# EAGLE design OpenBook (EAGLE 9.7.0)
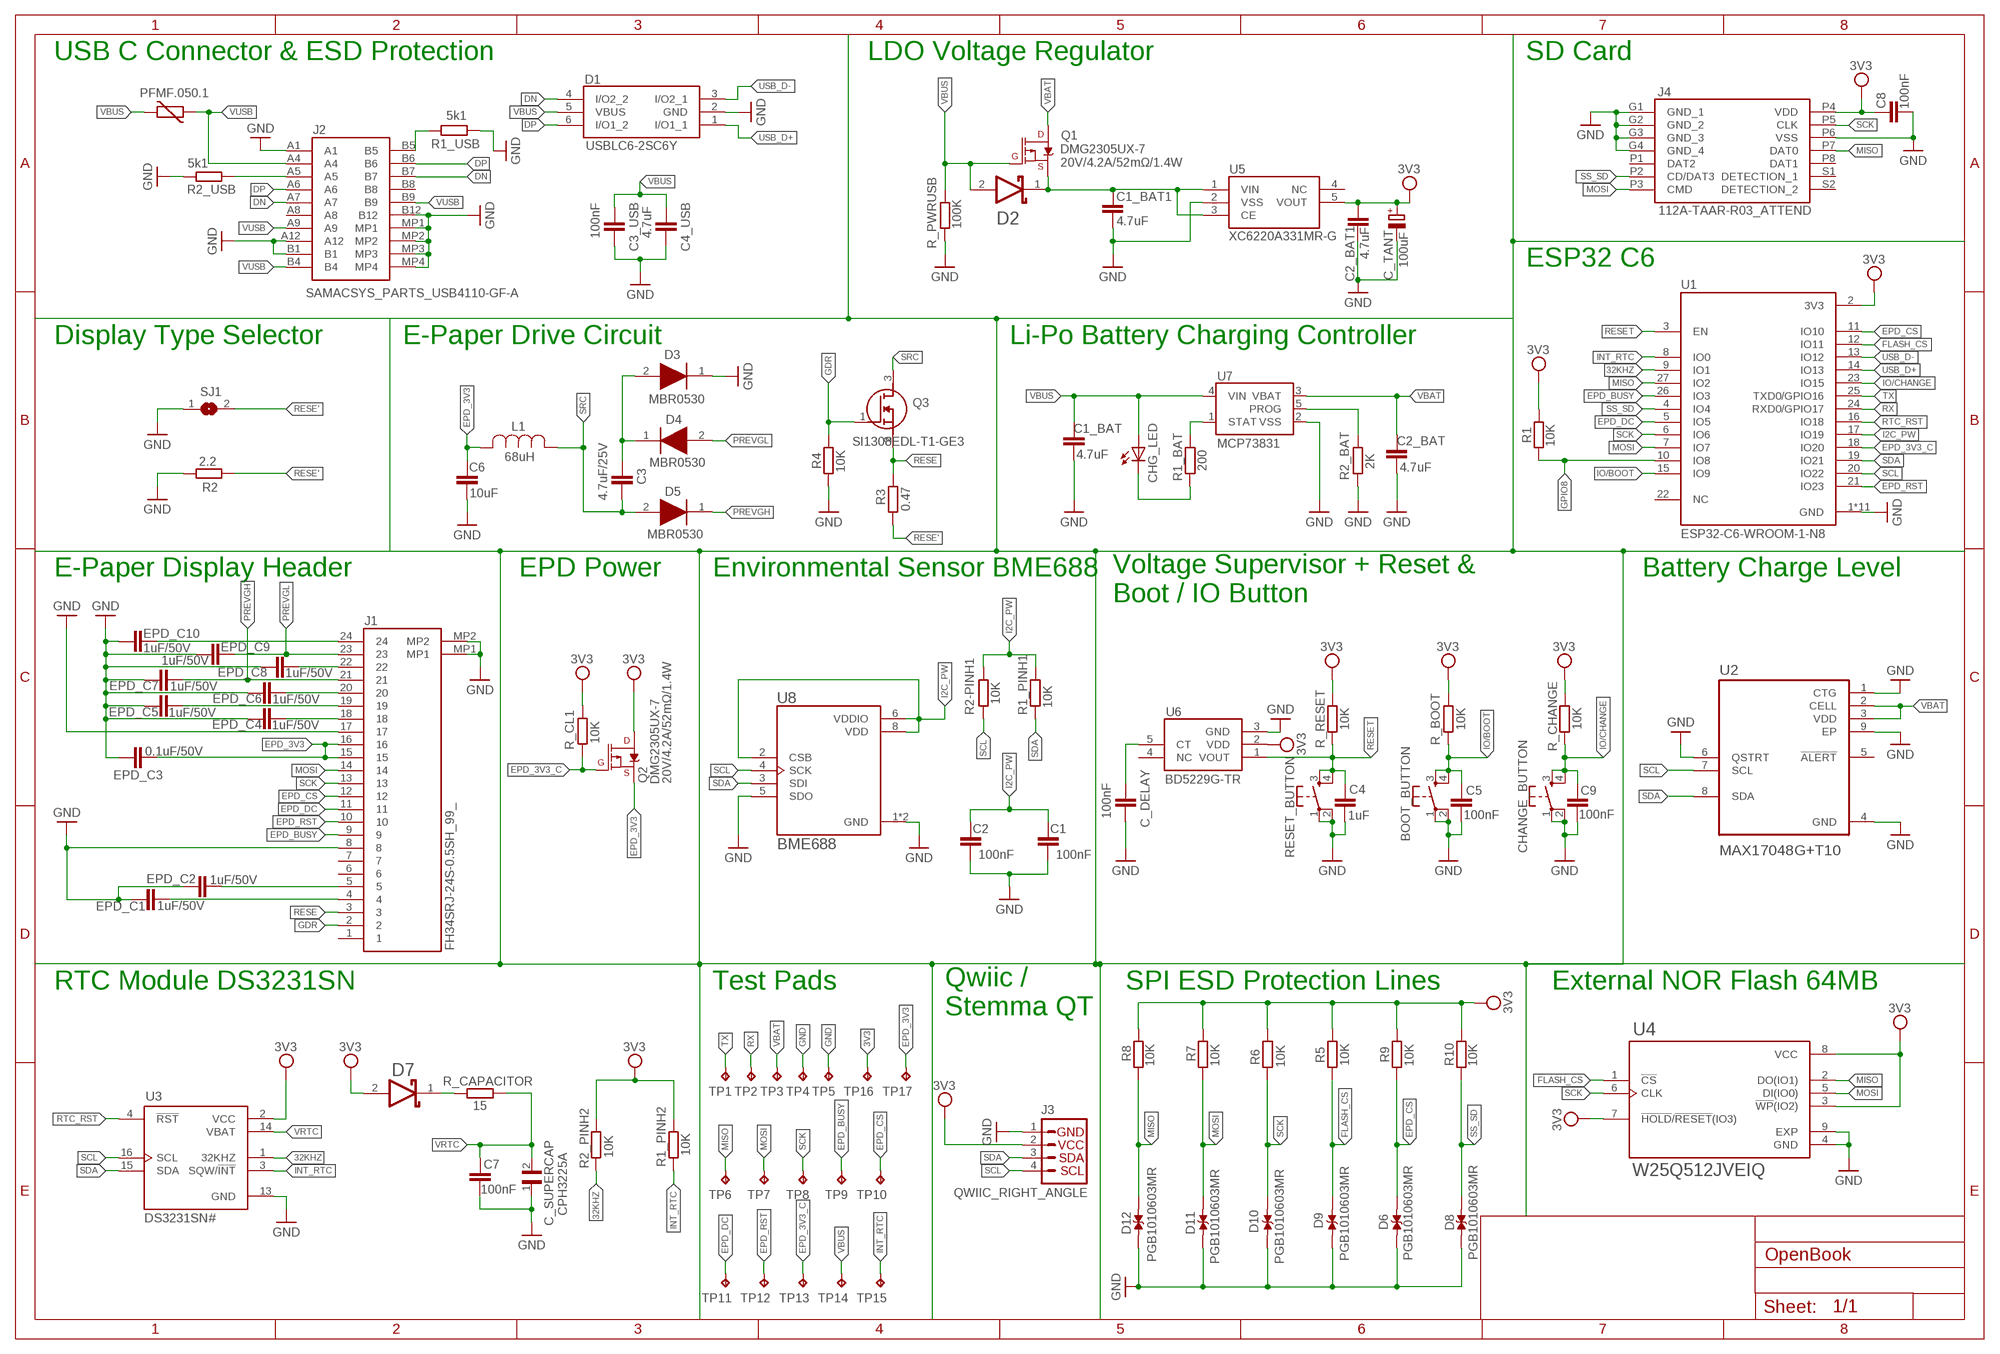
[diagram p0: schematic, sheet 1]

## Parts
BOOT_BUTTON  BUTTON_CUSYOMV1  [MYBUTTON]
C1  100nF  ESP32_WROVER_EAGLE-LTSPICE_C0402  [EAGLE-LTSPICE_C0402]
C1_BAT  4.7uF  ESP32_WROVER_EAGLE-LTSPICE_C0402  [EAGLE-LTSPICE_C0402]
C1_BAT1  4.7uF  ESP32_WROVER_EAGLE-LTSPICE_C0402  [EAGLE-LTSPICE_C0402]
C2  100nF  ESP32_WROVER_EAGLE-LTSPICE_C0402  [EAGLE-LTSPICE_C0402]
C2_BAT  4.7uF  ESP32_WROVER_EAGLE-LTSPICE_C0402  [EAGLE-LTSPICE_C0402]
C2_BAT1  4.7uF  ESP32_WROVER_EAGLE-LTSPICE_C0402  [EAGLE-LTSPICE_C0402]
C3  4.7uF/25V  ESP32_WROVER_EAGLE-LTSPICE_C0402  [EAGLE-LTSPICE_C0402]
C3_USB  100nF  ESP32_WROVER_EAGLE-LTSPICE_C0402  [EAGLE-LTSPICE_C0402]
C4  1uF  ESP32_WROVER_EAGLE-LTSPICE_C0402  [EAGLE-LTSPICE_C0402]
C4_USB  4.7uF  ESP32_WROVER_EAGLE-LTSPICE_C0402  [EAGLE-LTSPICE_C0402]
C5  100nF  ESP32_WROVER_EAGLE-LTSPICE_C0402  [EAGLE-LTSPICE_C0402]
C6  10uF  ESP32_WROVER_EAGLE-LTSPICE_C0402  [EAGLE-LTSPICE_C0402]
C7  100nF  ESP32_WROVER_EAGLE-LTSPICE_C0402  [EAGLE-LTSPICE_C0402]
C8  100nF  ESP32_WROVER_EAGLE-LTSPICE_C0402  [EAGLE-LTSPICE_C0402]
C9  100nF  ESP32_WROVER_EAGLE-LTSPICE_C0402  [EAGLE-LTSPICE_C0402]
C_DELAY  100nF  ESP32_WROVER_EAGLE-LTSPICE_C0402  [EAGLE-LTSPICE_C0402]
C_SUPERCAP  CPH3225A  [CAPCP3225X100N]
C_TANT  100uF  RCL_CPOL-EUCT3528  [RCL_CT3528]
CHANGE_BUTTON  BUTTON_CUSYOMV1  [MYBUTTON]
CHG_LED  ADAFRUIT_LEDCHIP-LED0603  [ADAFRUIT_CHIP-LED0603]
D1  USBLC6-2SC6Y  [SON50P200X200X80-9N]
D2  ESP32_WROVER_AVX---SD0805S020S1R0_AVX_SD0805S020S1R0_0_0AVX_SD0805S020S1R0_0_0  [ESP32_WROVER_AVX---SD0805S020S1R0_AVX_SD0805S020S1R0_0]
D3  MBR0530  [SOD3716X135N]
D4  MBR0530  [SOD3716X135N]
D5  MBR0530  [SOD3716X135N]
D6  PGB1010603MR  [DIOC1608X36N]
D7  ESP32_WROVER_AVX---SD0805S020S1R0_AVX_SD0805S020S1R0_0_0AVX_SD0805S020S1R0_0_0  [ESP32_WROVER_AVX---SD0805S020S1R0_AVX_SD0805S020S1R0_0]
D8  PGB1010603MR  [DIOC1608X36N]
D9  PGB1010603MR  [DIOC1608X36N]
D10  PGB1010603MR  [DIOC1608X36N]
D11  PGB1010603MR  [DIOC1608X36N]
D12  PGB1010603MR  [DIOC1608X36N]
EPD_C1  1uF/50V  ESP32_WROVER_EAGLE-LTSPICE_C0402  [EAGLE-LTSPICE_C0402]
EPD_C2  1uF/50V  ESP32_WROVER_EAGLE-LTSPICE_C0402  [EAGLE-LTSPICE_C0402]
EPD_C3  0.1uF/50V  ESP32_WROVER_EAGLE-LTSPICE_C0402  [EAGLE-LTSPICE_C0402]
EPD_C4  1uF/50V  ESP32_WROVER_EAGLE-LTSPICE_C0402  [EAGLE-LTSPICE_C0402]
EPD_C5  1uF/50V  ESP32_WROVER_EAGLE-LTSPICE_C0402  [EAGLE-LTSPICE_C0402]
EPD_C6  1uF/50V  ESP32_WROVER_EAGLE-LTSPICE_C0402  [EAGLE-LTSPICE_C0402]
EPD_C7  1uF/50V  ESP32_WROVER_EAGLE-LTSPICE_C0402  [EAGLE-LTSPICE_C0402]
EPD_C8  1uF/50V  ESP32_WROVER_EAGLE-LTSPICE_C0402  [EAGLE-LTSPICE_C0402]
EPD_C9  1uF/50V  ESP32_WROVER_EAGLE-LTSPICE_C0402  [EAGLE-LTSPICE_C0402]
EPD_C10  1uF/50V  ESP32_WROVER_EAGLE-LTSPICE_C0402  [EAGLE-LTSPICE_C0402]
J1  FH34SRJ-24S-0.5SH_99_  [FH34SRJ24S05SH99]
J2  SAMACSYS_PARTS_USB4110-GF-A  [SAMACSYS_PARTS_USB4110GFA]
J3  QWIIC_RIGHT_ANGLE  QWIIC_CONNECTORJS-1MM  [JST04_1MM_RA]
J4  112A-TAAR-R03_ATTEND  [112ATAARR03ATTEND]
L1  68uH  744043680IND_4828-WE-TPC_WRE  [IND_4828-WE-TPC_WRE]
PFMF.050.1  ESP32C6_VARISTORCN1812  [ESP32C6_VARISTOR_CT/CN1812]
Q1  20V/4.2A/52mΩ/1.4W  ESP32_WROVER_SPARKFUN-DISCRETESEMI_MOSFET_PCH-DMG2305UX-7  [ESP32_WROVER_SPARKFUN-DISCRETESEMI_SOT23-3]
Q2  20V/4.2A/52mΩ/1.4W  ESP32_WROVER_SPARKFUN-DISCRETESEMI_MOSFET_PCH-DMG2305UX-7  [ESP32_WROVER_SPARKFUN-DISCRETESEMI_SOT23-3]
Q3  SI1308EDL-T1-GE3  [SOT65P210X110-3N]
R1  10K  ESP32_WROVER_EAGLE-LTSPICE_RR0402  [ESP32_WROVER_EAGLE-LTSPICE_R0402]
R1_BAT  200  ESP32_WROVER_EAGLE-LTSPICE_RR0402  [ESP32_WROVER_EAGLE-LTSPICE_R0402]
R1_PINH1  10K  ESP32_WROVER_EAGLE-LTSPICE_RR0402  [ESP32_WROVER_EAGLE-LTSPICE_R0402]
R1_PINH2  10K  ESP32_WROVER_EAGLE-LTSPICE_RR0402  [ESP32_WROVER_EAGLE-LTSPICE_R0402]
R1_USB  5k1  ESP32_WROVER_EAGLE-LTSPICE_RR0402  [ESP32_WROVER_EAGLE-LTSPICE_R0402]
R2  2.2  ESP32_WROVER_EAGLE-LTSPICE_RR0402  [ESP32_WROVER_EAGLE-LTSPICE_R0402]
R2-PINH1  10K  ESP32_WROVER_EAGLE-LTSPICE_RR0402  [ESP32_WROVER_EAGLE-LTSPICE_R0402]
R2_BAT  2K  ESP32_WROVER_EAGLE-LTSPICE_RR0402  [ESP32_WROVER_EAGLE-LTSPICE_R0402]
R2_PINH2  10K  ESP32_WROVER_EAGLE-LTSPICE_RR0402  [ESP32_WROVER_EAGLE-LTSPICE_R0402]
R2_USB  5k1  ESP32_WROVER_EAGLE-LTSPICE_RR0402  [ESP32_WROVER_EAGLE-LTSPICE_R0402]
R3  0.47  ESP32_WROVER_EAGLE-LTSPICE_RR0402  [ESP32_WROVER_EAGLE-LTSPICE_R0402]
R4  10K  ESP32_WROVER_EAGLE-LTSPICE_RR0402  [ESP32_WROVER_EAGLE-LTSPICE_R0402]
R5  10K  ESP32_WROVER_EAGLE-LTSPICE_RR0402  [ESP32_WROVER_EAGLE-LTSPICE_R0402]
R6  10K  ESP32_WROVER_EAGLE-LTSPICE_RR0402  [ESP32_WROVER_EAGLE-LTSPICE_R0402]
R7  10K  ESP32_WROVER_EAGLE-LTSPICE_RR0402  [ESP32_WROVER_EAGLE-LTSPICE_R0402]
R8  10K  ESP32_WROVER_EAGLE-LTSPICE_RR0402  [ESP32_WROVER_EAGLE-LTSPICE_R0402]
R9  10K  ESP32_WROVER_EAGLE-LTSPICE_RR0402  [ESP32_WROVER_EAGLE-LTSPICE_R0402]
R10  10K  ESP32_WROVER_EAGLE-LTSPICE_RR0402  [ESP32_WROVER_EAGLE-LTSPICE_R0402]
R_BOOT  10K  ESP32_WROVER_EAGLE-LTSPICE_RR0402  [ESP32_WROVER_EAGLE-LTSPICE_R0402]
R_CAPACITOR  15  ESP32_WROVER_EAGLE-LTSPICE_RR0402  [ESP32_WROVER_EAGLE-LTSPICE_R0402]
R_CHANGE  10K  ESP32_WROVER_EAGLE-LTSPICE_RR0402  [ESP32_WROVER_EAGLE-LTSPICE_R0402]
R_CL1  10K  ESP32_WROVER_EAGLE-LTSPICE_RR0402  [ESP32_WROVER_EAGLE-LTSPICE_R0402]
R_PWRUSB  100K  ESP32_WROVER_EAGLE-LTSPICE_RR0402  [ESP32_WROVER_EAGLE-LTSPICE_R0402]
R_RESET  10K  ESP32_WROVER_EAGLE-LTSPICE_RR0402  [ESP32_WROVER_EAGLE-LTSPICE_R0402]
RESET_BUTTON  BUTTON_CUSYOMV1  [MYBUTTON]
SJ1  SJ  [SJ]
TP1  TPTP20R  [TP20R]
TP2  TPTP20R  [TP20R]
TP3  TPTP20R  [TP20R]
TP4  TPTP20R  [TP20R]
TP5  TPTP20R  [TP20R]
TP6  TPTP20R  [TP20R]
TP7  TPTP20R  [TP20R]
TP8  TPTP20R  [TP20R]
TP9  TPTP20R  [TP20R]
TP10  TPTP20R  [TP20R]
TP11  TPTP20R  [TP20R]
TP12  TPTP20R  [TP20R]
TP13  TPTP20R  [TP20R]
TP14  TPTP20R  [TP20R]
TP15  TPTP20R  [TP20R]
TP16  TPTP20R  [TP20R]
TP17  TPTP20R  [TP20R]
U1  ESP32-C6-WROOM-1-N8  [XCVR_ESP32-C6-WROOM-1-N8]
U2  MAX17048G+T10  [SON50P200X200X80-9N]
U3  DS3231SN#  [SOIC127P1032X265-16N]
U4  W25Q512JVEIQ  [SON127P600X800X80-9N]
U5  XC6220A331MR-G  [SOT95P280X120-5N]
U6  BD5229G-TR  [SOT95P280X125-5N]
U7  MCP73831  ESP32_WROVER_SPARKFUN-IC-POWER_MCP73831  [ESP32_WROVER_SPARKFUN-IC-POWER_SOT23-5]
U8  BME688  ESP32_WROVER_BME680_BME680  [ESP32_WROVER_BME680_PSON80P300X300X100-8N]

## Nets
3V3: C2_BAT1.1 C8.1 C_TANT.+ D7.2(ANODE) J3.2 J4.P4(VDD) Q2.3(D) R1.2 R1_PINH2.2 R2_PINH2.2 R5.2 R6.2 R7.2 R8.2 R9.2 R10.2 R_BOOT.2 R_CHANGE.2 R_CL1.2 R_RESET.2 TP16.TP U1.2(3V3) U3.2(VCC) U4.3(!WP!(IO2)) U4.7(!HOLD!/!RESET!(IO3)) U4.8(VCC) U5.5(VOUT) U6.2(VDD)
32KHZ: R2_PINH2.1 U1.9(IO1) U3.1(32KHZ)
DN: D1.4(I/O2_2) J2.A7 J2.B7
DP: D1.6(I/O1_2) J2.A6 J2.B6
EPD_3V3: C6.1 EPD_C3.2 J1.15 J1.16 L1.2 Q2.2(S) TP17.TP
EPD_3V3_C: Q2.1(G) R_CL1.1 TP13.TP U1.18(IO20)
EPD_BUSY: J1.9 TP9.TP U1.26(IO3)
EPD_CS: D6.2 J1.12 R9.1 TP10.TP U1.11(IO10)
EPD_DC: J1.11 TP11.TP U1.5(IO5)
EPD_RST: J1.10 TP12.TP U1.21(IO23)
FLASH_CS: D9.2 R5.1 U1.12(IO11) U4.1(!CS)
GDR: J1.2 Q3.1(G) R4.2
GND: BOOT_BUTTON.1 BOOT_BUTTON.2 C1.2 C1_BAT1.2 C1_BAT.2 C2.2 C2_BAT1.2 C2_BAT.2 C3_USB.2 C4.2 C4_USB.2 C5.2 C6.2 C7.2 C8.2 C9.2 C_DELAY.2 C_SUPERCAP.1 C_TANT.- CHANGE_BUTTON.1 CHANGE_BUTTON.2 D1.2(GND) D3.1(K) D6.1 D8.1 D9.1 D10.1 D11.1 D12.1 EPD_C1.1 EPD_C2.1 EPD_C3.1 EPD_C4.1 EPD_C5.1 EPD_C6.1 EPD_C7.1 EPD_C8.1 EPD_C9.1 EPD_C10.1 J1.8 J1.17 J1.MP1 J1.MP2 J2.A1 J2.A12 J2.B1 J2.B12 J2.MP1 J2.MP2 J2.MP3 J2.MP4 J3.1 J4.G1(GND_1) J4.G2(GND_2) J4.G3(GND_3) J4.G4(GND_4) J4.P6(VSS) R1_USB.2 R2.2 R2_BAT.1 R2_USB.1 R4.1 R_PWRUSB.1 RESET_BUTTON.1 RESET_BUTTON.2 SJ1.1 TP4.TP TP5.TP U1.1(GND) U1.28(GND) U1.29_1(GND) U1.29_2(GND) U1.29_3(GND) U1.29_4(GND) U1.29_5(GND) U1.29_6(GND) U1.29_7(GND) U1.29_8(GND) U1.29_9(GND) U2.1(CTG) U2.4(GND) U2.6(QSTRT) U2.9(EP) U3.13(GND) U4.4(GND) U4.9(EXP) U5.2(VSS) U6.3(GND) U7.2(VSS) U8.1(GND) U8.5(SDO) U8.7(GND)
GPIO8: R1.1 U1.10(IO8)
I2C_PW: C1.1 C2.1 R1_PINH1.2 R2-PINH1.2 U1.17(IO19) U8.2(CSB) U8.6(VDDIO) U8.8(VDD)
INT_RTC: R1_PINH2.1 TP15.TP U1.8(IO0) U3.3(SQW/!INT)
IO/BOOT: BOOT_BUTTON.3 BOOT_BUTTON.4 C5.1 R_BOOT.1 U1.15(IO9)
IO/CHANGE: C9.1 CHANGE_BUTTON.3 CHANGE_BUTTON.4 R_CHANGE.1 U1.23(IO15)
MISO: D12.2 J4.P7(DAT0) R8.1 TP6.TP U1.27(IO2) U4.2(DO(IO1))
MOSI: D11.2 J1.14 J4.P3(CMD) R7.1 TP7.TP U1.7(IO7) U4.5(DI(IO0))
N$1: C1_BAT1.1 D2.1(CATHODE) Q1.2(S) U5.1(VIN) U5.3(CE)
N$2: R1_BAT.2 U7.1(STAT)
N$3: C3.1 D3.2(A) D4.1(K)
N$4: J2.A5 R2_USB.2
N$5: CHG_LED.C R1_BAT.1
N$7: J2.B5 R1_USB.1
N$8: C_DELAY.1 U6.5(CT)
N$9: EPD_C8.2 J1.22
N$10: EPD_C6.2 J1.20
N$11: EPD_C4.2 J1.18
N$13: R2_BAT.2 U7.5(PROG)
N$14: EPD_C5.2 J1.19
N$15: EPD_C10.2 J1.24
N$16: D7.1(CATHODE) R_CAPACITOR.1
N$24: EPD_C2.2 J1.5
N$25: EPD_C1.2 J1.4
PREVGH: D5.1(K) EPD_C7.2 J1.21
PREVGL: D4.2(A) EPD_C9.2 J1.23
RESE: J1.3 Q3.2(S) R3.2
RESE': R2.1 R3.1 SJ1.2
RESET: C4.1 R_RESET.1 RESET_BUTTON.3 RESET_BUTTON.4 U1.3(EN) U6.1(VOUT)
RTC_RST: U1.16(IO18) U3.4(!RST)
RX: TP2.TP U1.24(RXD0/GPIO17)
SCK: D10.2 J1.13 J4.P5(CLK) R6.1 TP8.TP U1.6(IO6) U4.6(CLK)
SCL: J3.4 R2-PINH1.1 U1.20(IO22) U2.7(SCL) U3.16(SCL) U8.4(SCK)
SDA: J3.3 R1_PINH1.1 U1.19(IO21) U2.8(SDA) U3.15(SDA) U8.3(SDI)
SRC: C3.2 D5.2(A) L1.1 Q3.3(D)
SS_SD: D8.2 J4.P2(CD/DAT3) R10.1 U1.4(IO4)
TX: TP1.TP U1.25(TXD0/GPIO16)
USB_D+: D1.1(I/O1_1) U1.14(IO13)
USB_D-: D1.3(I/O2_1) U1.13(IO12)
VBAT: C2_BAT.1 Q1.3(D) TP3.TP U2.2(CELL) U2.3(VDD) U7.3(VBAT)
VBUS: C1_BAT.1 C3_USB.1 C4_USB.1 CHG_LED.A D1.5(VBUS) D2.2(ANODE) PFMF.050.1.2 Q1.1(G) R_PWRUSB.2 TP14.TP U7.4(VIN)
VRTC: C7.1 C_SUPERCAP.2 R_CAPACITOR.2 U3.14(VBAT)
VUSB: J2.A4 J2.A9 J2.B4 J2.B9 PFMF.050.1.1
Unconnected: J1.1 J1.6 J1.7 J2.A8 J2.B8 J4.P1(DAT2) J4.P8(DAT1) J4.S1(DETECTION_1) J4.S2(DETECTION_2) U1.22(NC) U2.5(!ALERT) U5.4(NC) U6.4(NC)

## Buses
B$1

## Notes on the sheet
- USB C Connector & ESD Protection | LDO Voltage Regulator | SD Card
- ESP32 C6
- Display Type Selector | E-Paper Drive Circuit | Li-Po Battery Charging Controller
- E-Paper Display Header | EPD Power | Environmental Sensor BME688 | Battery Charge Level
- Voltage Supervisor + Reset &
  Boot / IO Button
- RTC Module DS3231SN | Test Pads | SPI ESD Protection Lines | External NOR Flash 64MB
- Qwiic /
  Stemma QT

## Library data of the parts
BOOT_BUTTON CHANGE_BUTTON RESET_BUTTON = DeskAssistant v19 v1:BUTTON_CUSYOMV1
C1 C1_BAT C1_BAT1 C2 C2_BAT C2_BAT1 C3 C3_USB C4 C4_USB C5-C9 C_DELAY EPD_C1-EPD_C10 = DeskAssistant v19 v1:ESP32_WROVER_EAGLE-LTSPICE_C: CAPACITOR, European symbol
C_SUPERCAP = DeskAssistant v19 v1:CPH3225A: Cap 0.011F 3.3V 1210 Flat Check availability <https://pricing.snapeda.com/parts/CPH3225A/Seiko%20Instruments/view-part?ref=eda>
C_TANT = DeskAssistant v19 v1:RCL_CPOL-EU: POLARIZED CAPACITOR, European symbol; SPICEPREFIX: C
CHG_LED = DeskAssistant v19 v1:ADAFRUIT_LED: LED OSRAM: - CHIPLED LG R971, LG N971, LY N971, LG Q971, LY Q971, LO R971, LY R971 LH N974, LH R974 LS Q976, LO Q976, LY Q976 LO Q996 - Hyper CHIPLED LW Q18S LB Q993, LB Q99A, LB R99A - SideLED LS A670, LO A670, LY A670, LG A670, LP A670 LB A673, LV A673, LT A673, LW A673 LH A674 LY A675 LS A676, LA A676, LO A676, LY A676, LW A676 LS A679, LY A679, LG A679 - Hyper Micro SIDELED® LS Y876, LA Y876, LO Y876, LY Y876 LT Y87S - SmartLED LW L88C, LW L88S LB L89C, LB L89S, LG L890 LS L89K, LO L89K, LY L89K LS L896, LA L896, LO L896, LY L896 - TOPLED LS T670, LO T670, LY T670, LG T670, LP T670 LSG T670, LSP T670, LSY T670, LOP T670, LYG T670 LG T671, LOG T671, LSG T671 LB T673, LV T673, LT T673, LW T673 LH T674 LS T676, LA T676, LO T676, LY T676, LB T676, LH T676, LSB T676, LW T676 LB T67C, LV T67C, LT T67C, LS T67K, LO T67K, LY T67K, LW E67C LS E67B, LA E67B, LO E67B, LY E67B, LB E67C, LV E67C, LT E67C LW T67C LS T679, LY T679, LG T679 LS T770, LO T770, LY T770, LG T770, LP T770 LB T773, LV T773, LT T773, LW T773 LH T774 LS E675, LA E675, LY E675, LS T675 LS T776, LA T776, LO T776, LY T776, LB T776 LHGB T686 LT T68C, LB T68C - Hyper Mini TOPLED® LB M676 - Mini TOPLED Santana® LG M470 LS M47K, LO M47K, LY M47K Source: http://www.osram.convergy.de/
D1 = DeskAssistant v19 v1:USBLC6-2SC6Y: Low Cap. ESD Protection Auto SOT-23-6 STMicroelectronics USBLC6-2SC6Y, Dual Uni-Directional TVS Diode Array, 6-Pin SOT-23 Source: Datasheet <https://componentsearchengine.com/Datasheets/1/USBLC6-2SC6Y.pdf> Check availability <https://pricing.snapeda.com/parts/USBLC6-2SC6Y/STMicroelectronics/view-part?ref=eda>; AVAILABILITY: In Stock; CHECK_PRICES: https://www.snapeda.com/parts/USBLC6-2SC6Y/STMicroelectronics/view-part/?ref=eda; DESCRIPTION: 17V Clamp 5A (8/20µs) Ipp Tvs Diode Surface Mount SOT-23-6; FF: FF; MF: STMicroelectronics; MP: USBLC6-2SC6Y; PACKAGE: SOT-23-6 STMicroelectronics; PRICE: None; SNAPEDA_LINK: https://www.snapeda.com/parts/USBLC6-2SC6Y/STMicroelectronics/view-part/?ref=snap
D2 D7 = DeskAssistant v19 v1:ESP32_WROVER_AVX---SD0805S020S1R0_AVX_SD0805S020S1R0_0_0: Schottky Barrier Rectifier Diode
D3-D5 = DeskAssistant v19 v1:MBR0530: ON SEMICONDUCTOR - MBR0530 - DIODE, SCHOTTKY, 0.5A, 30V, SOD-123 Source: Datasheet <http://www.onsemi.com/pub/Collateral/MBR0530T1-D.PDF> Check availability <https://pricing.snapeda.com/parts/MBR0530/ON%20Semiconductor/view-part?ref=eda>; AVAILABILITY: In Stock; CHECK_PRICES: https://www.snapeda.com/parts/MBR0530/Onsemi/view-part/?ref=eda; DESCRIPTION: Diode Schottky 30 V 500mA Surface Mount SOD-123; MF: ON Semiconductor; MP: MBR0530; PACKAGE: SOD-123-2 ON Semiconductor; PRICE: None; PURCHASE-URL: https://www.snapeda.com/api/url_track_click_mouser/?unipart_id=179458&manufacturer=ON Semiconductor&part_name=MBR0530&search_term=None; SNAPEDA_LINK: https://www.snapeda.com/parts/MBR0530/Onsemi/view-part/?ref=snap
D6 D8-D12 = DeskAssistant v19 v1:PGB1010603MR: Check availability <https://pricing.snapeda.com/parts/PGB1010603MR/Littelfuse%20Inc./view-part?ref=eda>; AVAILABILITY: In Stock; CHECK_PRICES: https://www.snapeda.com/parts/PGB1010603MR/Littelfuse/view-part/?ref=eda; DESCRIPTION: 150V (Typ) Clamp - Ipp Tvs Diode Surface Mount 0603 (1608 Metric); MF: Littelfuse Inc.; MP: PGB1010603MR; PACKAGE: 0603 Littelfuse Inc.; PRICE: None; PURCHASE-URL: https://www.snapeda.com/api/url_track_click_mouser/?unipart_id=5659453&manufacturer=Littelfuse Inc.&part_name=PGB1010603MR&search_term=None; SNAPEDA_LINK: https://www.snapeda.com/parts/PGB1010603MR/Littelfuse/view-part/?ref=snap
J1 = DeskAssistant v19 v1:FH34SRJ-24S-0.5SH_99_: 24 Position FFC, FPC Connector Contacts, Top and Bottom 0.020" (0.50mm) Surface Mount, Right Angle Source: Datasheet <https://www.hirose.com/en/product/document?clcode=CL0580-1255-6-99&productname=FH34SRJ-24S-0.5SH(99)&series=FH34SRJ&documenttype=2DDrawing&lang=en&documentid=0000990903>; DESCRIPTION: 24 Position FFC, FPC Connector Contacts, Top and Bottom 0.020" (0.50mm) Surface Mount, Right Angle; HEIGHT: 1.1mm; MANUFACTURER_NAME: Hirose; MANUFACTURER_PART_NUMBER: FH34SRJ-24S-0.5SH(99); MOUSER_PART_NUMBER: 798-FH34SRJ24S05SH99; MOUSER_PRICE-STOCK: https://www.mouser.co.uk/ProductDetail/Hirose-Connector/FH34SRJ-24S-0.5SH99?qs=vcbW%252B4%252BSTIpKBl5ap9J8Fw%3D%3D
J2 = DeskAssistant v19 v1:SAMACSYS_PARTS_USB4110-GF-A: CONN USB 2.0 TYPE-C R/A SMT Source: Datasheet <https://gct.co/files/drawings/usb4110.pdf>; DESCRIPTION: CONN USB 2.0 TYPE-C R/A SMT; HEIGHT: 3.26mm; MANUFACTURER_NAME: GCT (GLOBAL CONNECTOR TECHNOLOGY); MANUFACTURER_PART_NUMBER: USB4110-GF-A; MOUSER_PART_NUMBER: 640-USB4110-GF-A; MOUSER_PRICE-STOCK: https://www.mouser.co.uk/ProductDetail/GCT/USB4110-GF-A?qs=KUoIvG%2F9IlYiZvIXQjyJeA%3D%3D
J3 = DeskAssistant v19 v1:QWIIC_CONNECTOR: SparkFun I2C Standard Qwiic Connector An SMD 1mm pitch JST connector makes it easy and quick (get it? Qwiic?) to connect I2C devices to each other. The Qwiic system <http://www.sparkfun.com/qwiic> enables fast and solderless connection between popular platforms and various sensors and actuators. We carry 200mm <https://www.sparkfun.com/products/14204>, 100mm <https://www.sparkfun.com/products/14205>, 50mm <https://www.sparkfun.com/products/14206>, and breadboard friendly <https://www.sparkfun.com/products/14207> Qwiic cables. We also offer 10 pcs strips <https://www.sparkfun.com/products/14323> the SMD connectors.; PROD_ID: CONN-13694
J4 = DeskAssistant v19 v1:112A-TAAR-R03_ATTEND: Micro SD Card Socket, Push-Push Type, Top Mount, SMT, H=1.83mm, 10u Source: Datasheet <https://www.attend.com.tw/data/download/file/112A-TAAR-R03.pdf>
L1 = DeskAssistant v19 v1:744043680
PFMF.050.1 = DeskAssistant v19 v1:ESP32C6_VARISTOR: VARISTOR
Q1 Q2 = DeskAssistant v19 v1:ESP32_WROVER_SPARKFUN-DISCRETESEMI_MOSFET_PCH: P-channel MOSFETs Voltage controlled devices that allow control of high current outputs. SparkFun Products: SparkFun ESP32 Thing <https://www.sparkfun.com/products/13907> SparkFun ESP8266 Thing <https://www.sparkfun.com/products/13231> SparkFun Pi Servo HAT V2 <https://www.sparkfun.com/products/15316> DMG2305UX-7 (20V/4.2A/SOT23-3); PROD_ID: DMG2305UX-7
Q3 = DeskAssistant v19 v1:SI1308EDL-T1-GE3: MOSFET N-Ch 30V 1.5A TrenchFET SC70 Vishay Si1308EDL-T1-GE3 N-channel MOSFET Transistor, 1.5 A, 30 V, 3-Pin SC-70 Source: Datasheet <https://componentsearchengine.com/Datasheets/1/SI1308EDL-T1-GE3.pdf> Check availability <https://pricing.snapeda.com/parts/SI1308EDL-T1-GE3/Vishay%20Siliconix/view-part?ref=eda>; AVAILABILITY: In Stock; CHECK_PRICES: https://www.snapeda.com/parts/SI1308EDL-T1-GE3/Vishay+Siliconix/view-part/?ref=eda; DESCRIPTION: Si1308EDL-T1-GE3 N-channel MOSFET Transistor, 1.5 A, 30 V, 3-Pin SC-70 | Siliconix / Vishay SI1308EDL-T1-GE3; MF: Vishay Siliconix; MP: SI1308EDL-T1-GE3; PACKAGE: SOT-323 Vishay Semiconductor; PRICE: None; PURCHASE-URL: https://www.snapeda.com/api/url_track_click_mouser/?unipart_id=274603&manufacturer=Vishay Siliconix&part_name=SI1308EDL-T1-GE3&search_term=None; SNAPEDA_LINK: https://www.snapeda.com/parts/SI1308EDL-T1-GE3/Vishay+Siliconix/view-part/?ref=snap
R1 R1_BAT R1_PINH1 R1_PINH2 R1_USB R2 R2-PINH1 R2_BAT R2_PINH2 R2_USB R3-R10 R_BOOT R_CAPACITOR R_CHANGE R_CL1 R_PWRUSB R_RESET = DeskAssistant v19 v1:ESP32_WROVER_EAGLE-LTSPICE_R: RESISTOR, European symbol; SPICEMODEL: NONE; SPICEPREFIX: R
SJ1 = DeskAssistant v19 v1:SJ: SMD solder JUMPER
TP1 = DeskAssistant v19 v1:TP: Test pad; TP_SIGNAL_NAME: TX
TP2 = DeskAssistant v19 v1:TP: Test pad; TP_SIGNAL_NAME: RX
TP3 = DeskAssistant v19 v1:TP: Test pad; TP_SIGNAL_NAME: VBAT
TP4 TP5 = DeskAssistant v19 v1:TP: Test pad; TP_SIGNAL_NAME: GND
TP6 = DeskAssistant v19 v1:TP: Test pad; TP_SIGNAL_NAME: MISO
TP7 = DeskAssistant v19 v1:TP: Test pad; TP_SIGNAL_NAME: MOSI
TP8 = DeskAssistant v19 v1:TP: Test pad; TP_SIGNAL_NAME: SCK
TP9 = DeskAssistant v19 v1:TP: Test pad; TP_SIGNAL_NAME: EPD_BUSY
TP10 = DeskAssistant v19 v1:TP: Test pad; TP_SIGNAL_NAME: EPD_CS
TP11 = DeskAssistant v19 v1:TP: Test pad; TP_SIGNAL_NAME: EPD_DC
TP12 = DeskAssistant v19 v1:TP: Test pad; TP_SIGNAL_NAME: EPD_RST
TP13 = DeskAssistant v19 v1:TP: Test pad; TP_SIGNAL_NAME: EPD_3V3_c
TP14 = DeskAssistant v19 v1:TP: Test pad; TP_SIGNAL_NAME: VBUS
TP15 = DeskAssistant v19 v1:TP: Test pad; TP_SIGNAL_NAME: INT_RTC
TP16 = DeskAssistant v19 v1:TP: Test pad; TP_SIGNAL_NAME: 3V3
TP17 = DeskAssistant v19 v1:TP: Test pad; TP_SIGNAL_NAME: EPD_3V3
U1 = DeskAssistant v19 v1:ESP32-C6-WROOM-1-N8: Check availability <https://pricing.snapeda.com/parts/ESP32-C6-WROOM-1-N8/Espressif%20Systems/view-part?ref=eda>
U2 = DeskAssistant v19 v1:MAX17048G+T10: Check availability <https://pricing.snapeda.com/parts/MAX17048G%2BT10/Analog%20Devices/view-part?ref=eda>; AVAILABILITY: In Stock; CHECK_PRICES: https://www.snapeda.com/parts/MAX17048G+T10/Analog+Devices/view-part/?ref=eda; DESCRIPTION: 3µA 1-Cell/2-Cell Fuel Gauge with ModelGauge; MF: Analog Devices; MP: MAX17048G+T10; PACKAGE: TDFN-8 Maxim; PRICE: None; PURCHASE-URL: https://www.snapeda.com/api/url_track_click_mouser/?unipart_id=329239&manufacturer=Analog Devices&part_name=MAX17048G+T10&search_term=None; SNAPEDA_LINK: https://www.snapeda.com/parts/MAX17048G+T10/Analog+Devices/view-part/?ref=snap
U3 = DeskAssistant v19 v1:DS3231SN#: Real Time Clock Serial 16-Pin SOIC W T/R Check availability <https://pricing.snapeda.com/parts/DS3231SN%23/Analog%20Devices/view-part?ref=eda>
U4 = DeskAssistant v19 v1:W25Q512JVEIQ: Check availability <https://pricing.snapeda.com/parts/W25Q512JVEIQ/Winbond%20Electronics/view-part?ref=eda>; AVAILABILITY: In Stock; CHECK_PRICES: https://www.snapeda.com/parts/W25Q512JVEIQ/Winbond+Electronics/view-part/?ref=eda; DESCRIPTION: FLASH - NOR Memory IC 512Mb (64M x 8) SPI - Quad I/O 133 MHz 8-WSON (8x6); MF: Winbond Electronics; MP: W25Q512JVEIQ; PACKAGE: Package; PRICE: None; SNAPEDA_LINK: https://www.snapeda.com/parts/W25Q512JVEIQ/Winbond+Electronics/view-part/?ref=snap
U5 = DeskAssistant v19 v1:XC6220A331MR-G: LDO Voltage Regulators Source: Datasheet <https://www.torexsemi.com/file/xc6220/XC6220.pdf>; DESCRIPTION: LDO Voltage Regulators; HEIGHT: 1.2mm; MANUFACTURER_NAME: Torex; MANUFACTURER_PART_NUMBER: XC6220A331MR-G; MOUSER_PART_NUMBER: 865-XC6220A331MR-G; MOUSER_PRICE-STOCK: https://www.mouser.co.uk/ProductDetail/Torex-Semiconductor/XC6220A331MR-G?qs=AsjdqWjXhJ8ZSWznL1J0gg%3D%3D
U6 = DeskAssistant v19 v1:BD5229G-TR: Voltage Detector with Adjustable Delay Time: CMOS processes are utilized to develop high precision, low current consumption CMOS reset ICs that allow arbitrary setting of the delay time. The extensive lineup includes both Nch Open Drain and CMOS output types in a wide range of detection voltages (from 2.3V to 6.0V, in 0.1V steps), enabling selection of the ideal solution based on customer requirements. In addition, the entire series is of course both lead-free and RoHS-compliant. Source: Datasheet <https://datasheet.datasheetarchive.com/originals/distributors/Datasheets_SAMA/f2b9741ef86007909f138d561a359946.pdf>
U7 = DeskAssistant v19 v1:ESP32_WROVER_SPARKFUN-IC-POWER_MCP73831: MCP73831T Li-Ion, Li-Pol Controller Miniature single cell, fully integrated Li-Ion, Li-polymer charge management controller Datasheet <http://ww1.microchip.com/downloads/en/DeviceDoc/20001984g.pdf> SparkFun Products: SparkFun ESP32 Thing <https://www.sparkfun.com/products/13907> SparkFun 9DoF Razor IMU M0 <https://www.sparkfun.com/products/14001>; PROD_ID: IC-09995
U8 = DeskAssistant v19 v1:ESP32_WROVER_BME680_BME680: Integrated Environmental Unit; AVAILABILITY: Unavailable; DESCRIPTION: Integrated Environmental Unit; MF: Bosch Sensortec; MP: BME680; PACKAGE: LGA-8 Bosch Tools; PRICE: None

## Board
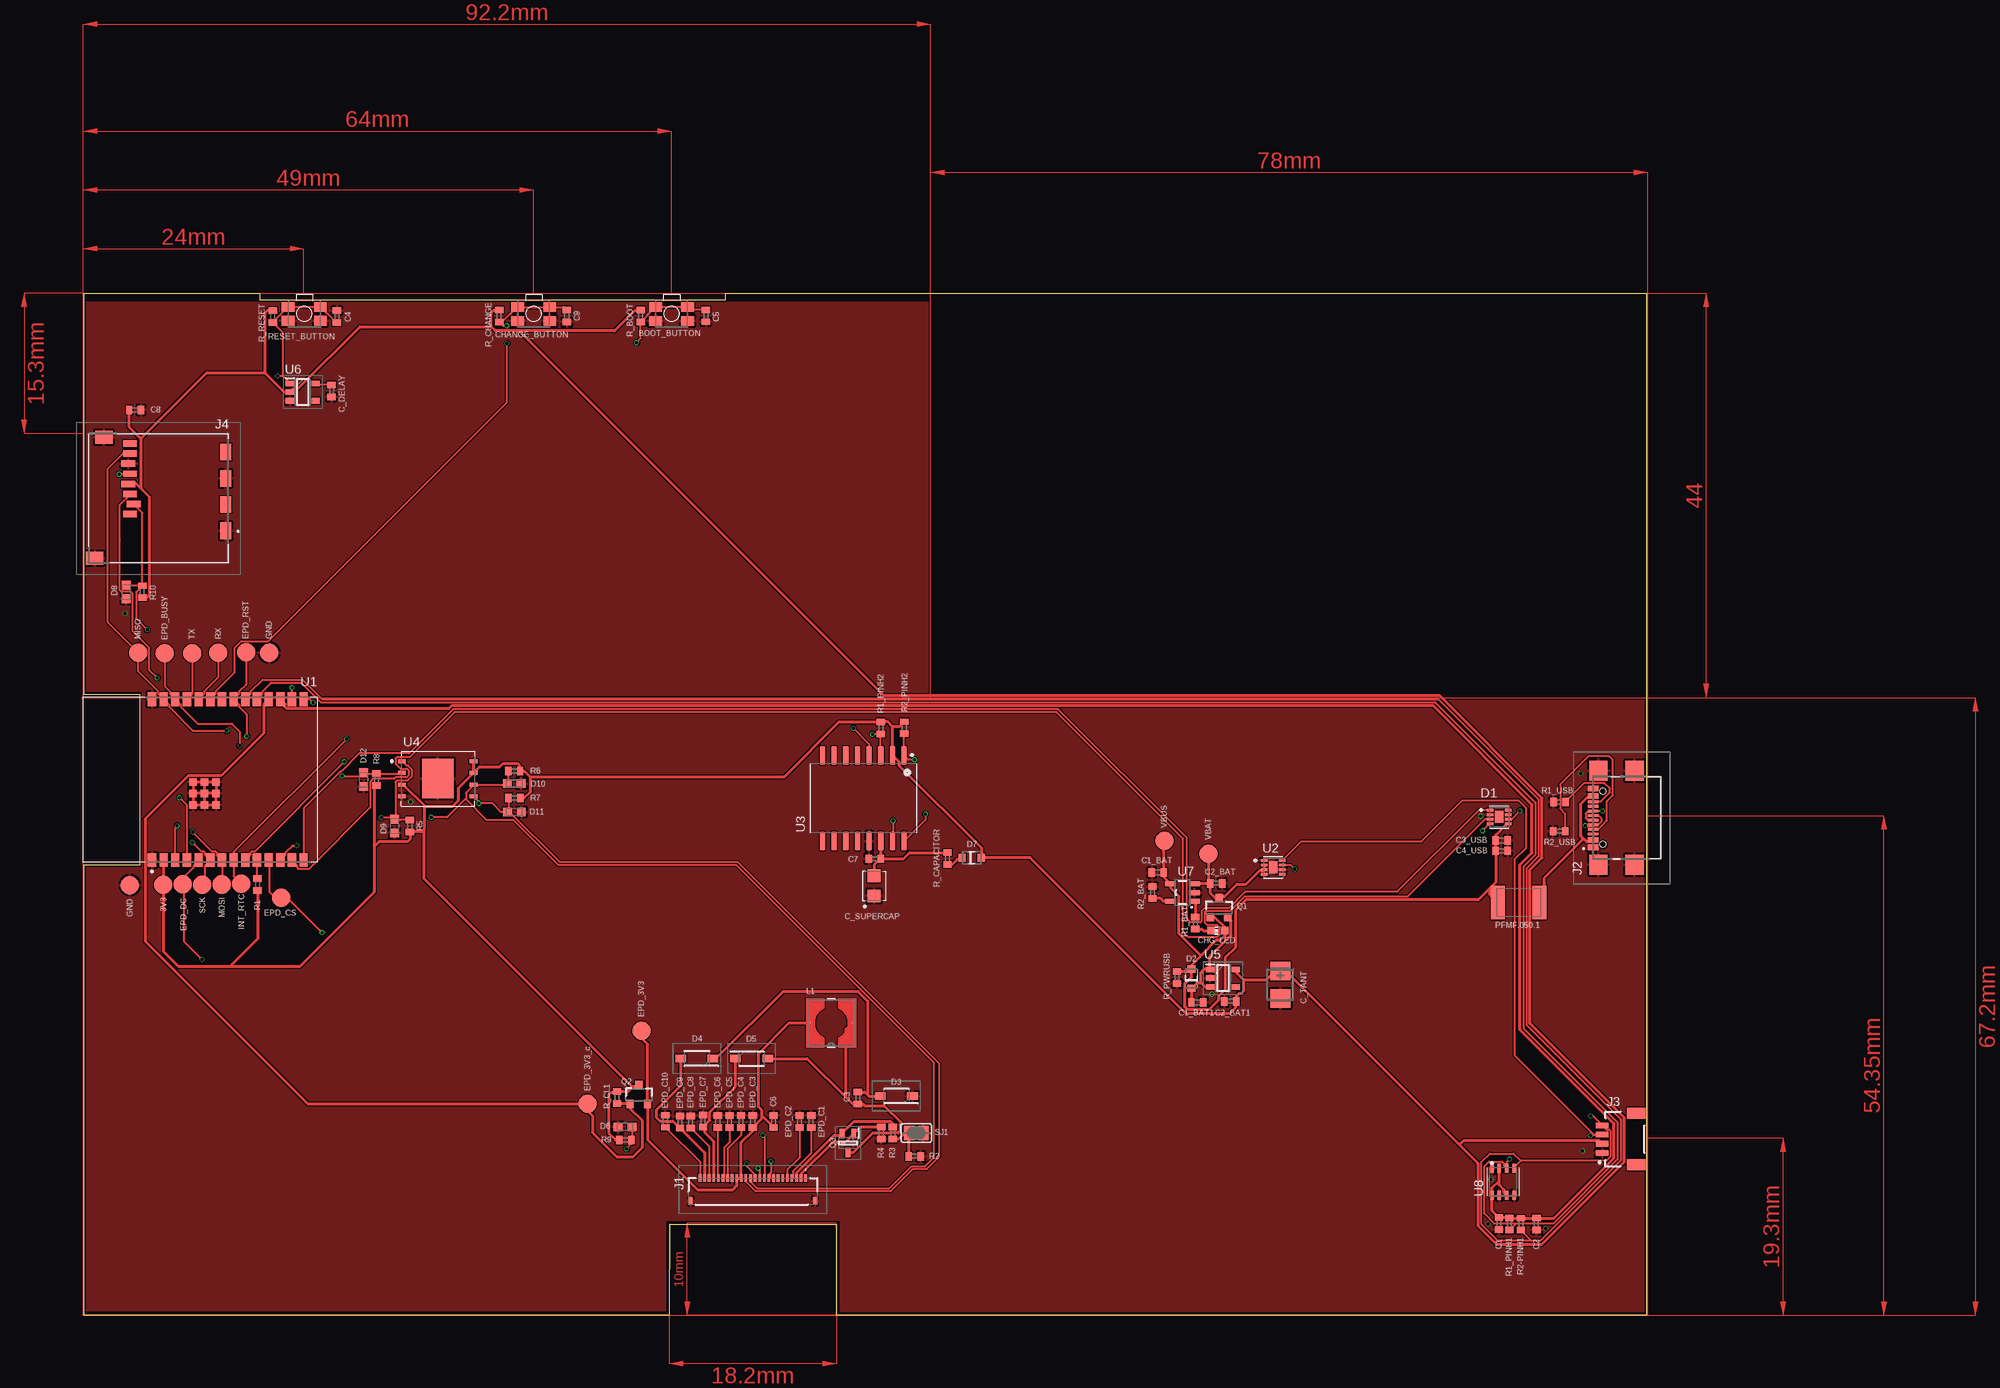
[diagram p1: board, top side]
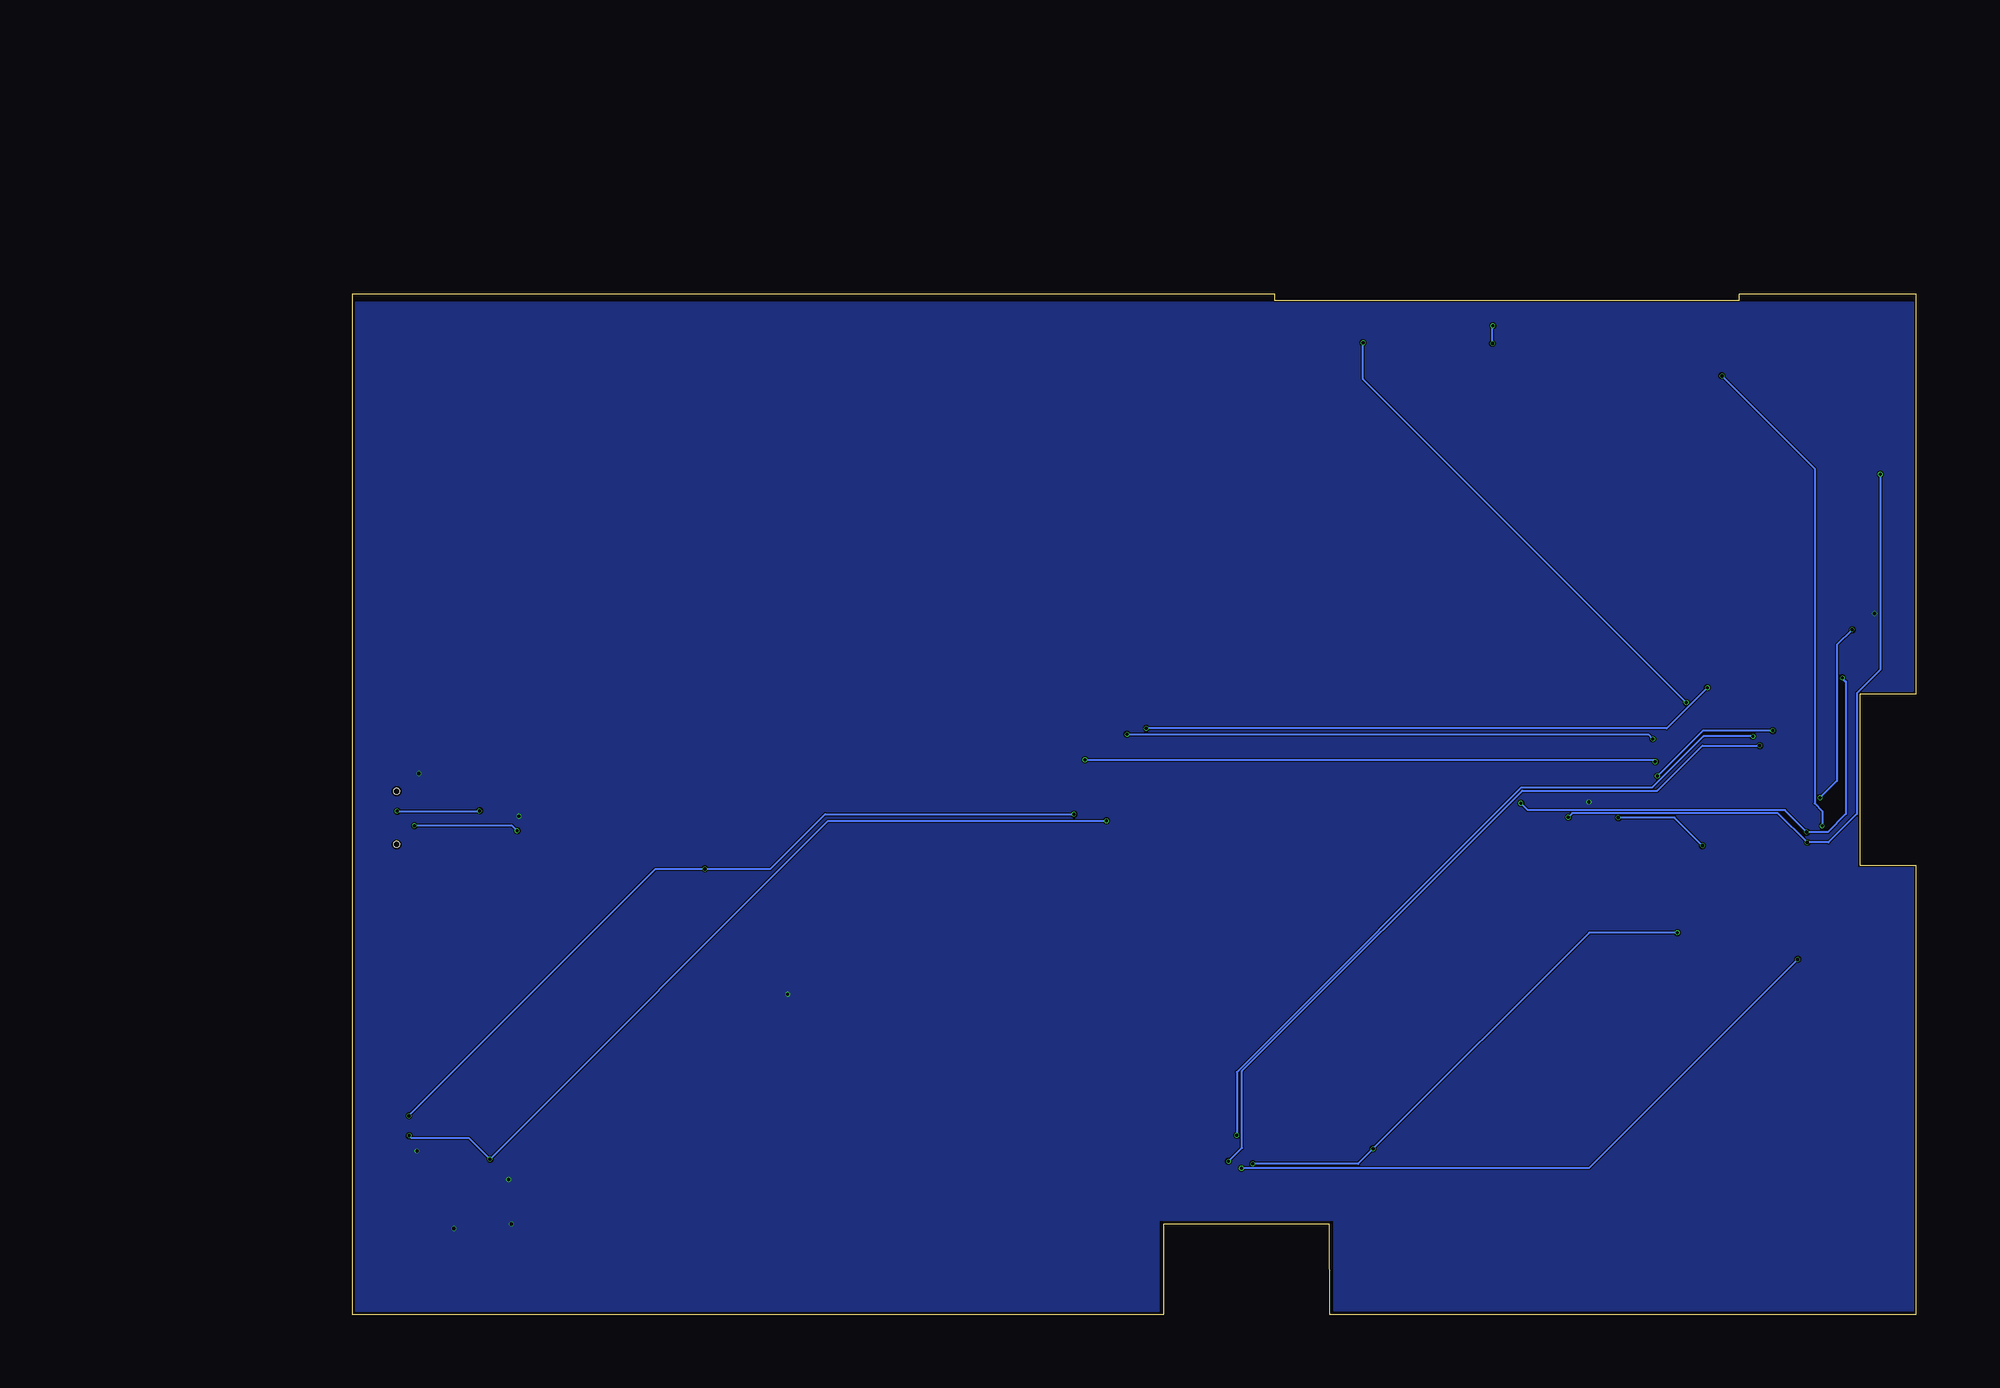
[diagram p2: board, bottom side, seen from below]

Size 170.08 x 111.07 mm. Coordinates in mm from the lower left corner, seen from the top.
Outline: 0,0 63.76,0 63.76,9.87 81.82,9.87 81.82,0 170.08,0 170.08,111.07 69.75,111.07 69.75,110.38 19.21,110.38 19.21,111.07 0,111.07 0,67.51 6.11,67.5 6.11,48.92 0,48.93 0,0
Outline: 0,0 0,0
Copper layers (1*16): Top 0.035mm / dielectric 1.6mm / Bottom 0.035mm
Design rules "jlcpcb-2layers.dru": minimum track width 0.2mm, minimum drill 0.3mm, track to track 5mil, track to pad 5mil, pad to pad 5mil, via to via 5mil, smd to smd 5mil, copper to edge 0.2mm, drill to drill 6mil, minimum pad ring 10mil, minimum via ring 3mil, stop-mask expansion 4mil, vias tented up to drill 0mil, thermal gap 10mil

### Footprints (pad centres in the part's own frame; a part is rotated, then mirrored left to right if it is on the bottom)
MYBUTTON = smd 1.4 x 1.05: 1 1.75,0.75; 2 -1.75,0.75; 3 -1.75,-0.75; 4 1.75,-0.75
EAGLE-LTSPICE_C0402 = smd 0.7 x 0.9: 1 -0.65,0; 2 0.65,0
CAPCP3225X100N = smd 1.4 x 1.4: 1 -1.1,0; 2 1.1,0
RCL_CT3528 = smd 2 x 2.2: + -1.5,0; - 1.5,0
ADAFRUIT_CHIP-LED0603 = smd 0.8 x 0.8: A 0,-0.75; C 0,0.75
SON50P200X200X80-9N = smd 0.76 x 0.27: 1 -0.985,0.75; 2 -0.985,0.25; 3 -0.985,-0.25; 4 -0.985,-0.75; 5 0.985,-0.75; 6 0.985,-0.25; 7 0.985,0.25; 8 0.985,0.75 | smd 0.9 x 1.3: 9 0,0
ESP32_WROVER_AVX---SD0805S020S1R0_AVX_SD0805S020S1R0_0 = smd 0.8 x 0.9: 1 -1.05,0; 2 1.05,0
SOD3716X135N = smd 1.15 x 0.8: 1 -1.75,0; 2 1.75,0
DIOC1608X36N = smd 0.97 x 0.94: 1 -0.75,0; 2 0.75,0
FH34SRJ24S05SH99 = smd 0.3 x 0.8: 1 5.75,1.45; 2 5.25,1.45; 3 4.75,1.45; 4 4.25,1.45; 5 3.75,1.45; 6 3.25,1.45; 7 2.75,1.45; 8 2.25,1.45; 9 1.75,1.45; 10 1.25,1.45; 11 0.75,1.45; 12 0.25,1.45; 13 -0.25,1.45; 14 -0.75,1.45; 15 -1.25,1.45; 16 -1.75,1.45; 17 -2.25,1.45; 18 -2.75,1.45; 19 -3.25,1.45; 20 -3.75,1.45; 21 -4.25,1.45; 22 -4.75,1.45; 23 -5.25,1.45; 24 -5.75,1.45 | smd 0.4 x 0.8: MP1 6.75,-1.05; MP2 -6.75,-1.05
SAMACSYS_PARTS_USB4110GFA = smd 0.3 x 1.15: A1 -3.35,3.678; A4 -2.55,3.678; A5 -1.25,3.678; A6 -0.25,3.678; A7 0.25,3.678; A8 1.25,3.678; A9 2.55,3.678; A12 3.35,3.678; B1 3.05,3.678; B4 2.25,3.678; B5 1.75,3.678; B6 0.75,3.678; B7 -0.75,3.678; B8 -1.75,3.678; B9 -2.25,3.678; B12 -3.05,3.678 | smd 2.18 x 2: MP1 -5.11,-0.827; MP2 5.11,-0.827; MP3 -5.11,3.103; MP4 5.11,3.103 | hole 0.65: -2.89,2.603; 2.89,2.603
JST04_1MM_RA = smd 0.6 x 1.35: 1 -1.5,0; 2 -0.5,0; 3 0.5,0; 4 1.5,0 | smd 1.2 x 2: NC1 2.8,-3.675; NC2 -2.8,-3.675
112ATAARR03ATTEND = smd 1.8 x 1.2: G1 10.6,10.4; G2 4.9,10.4; S1 7.75,10.4; S2 2.05,10.4 | smd 1.4 x 1.9: G3 13.6,-3.85; G4 0.45,-2.85 | smd 0.7 x 1.5: P1 8.8,0; P2 7.7,0.4; P3 6.6,0; P4 5.5,-0.2; P5 4.4,0; P6 3.3,-0.2; P7 2.2,0; P8 1.1,0
IND_4828-WE-TPC_WRE = smd 0.127 x 0.127: 1 -2.286,0; 2 2.286,0
ESP32C6_VARISTOR_CT/CN1812 = smd 1.5 x 3.6: 1 -2.25,0; 2 2.25,0
ESP32_WROVER_SPARKFUN-DISCRETESEMI_SOT23-3 = smd 0.8 x 0.9: 1 -0.95,-1; 2 0.95,-1; 3 0,1.1
SOT65P210X110-3N = smd 1.05 x 0.5: 1 -1.05,0.65; 2 -1.05,-0.65; 3 1.05,0
ESP32_WROVER_EAGLE-LTSPICE_R0402 = smd 0.7 x 0.9: 1 -0.65,0; 2 0.65,0
SJ = smd 1.168 x 1.6: 1 -0.762,0; 2 0.762,0
TP20R = smd 2 x 2: TP 0,0
XCVR_ESP32-C6-WROOM-1-N8 = smd 1.5 x 0.9: 1 -8.75,5.26; 2 -8.75,3.99; 3 -8.75,2.72; 4 -8.75,1.45; 5 -8.75,0.18; 6 -8.75,-1.09; 7 -8.75,-2.36; 8 -8.75,-3.63; 9 -8.75,-4.9; 10 -8.75,-6.17; 11 -8.75,-7.44; 12 -8.75,-8.71; 13 -8.75,-9.98; 14 -8.75,-11.25; 15 8.75,-11.25; 16 8.75,-9.98; 17 8.75,-8.71; 18 8.75,-7.44; 19 8.75,-6.17; 20 8.75,-4.9; 21 8.75,-3.63; 22 8.75,-2.36; 23 8.75,-1.09; 24 8.75,0.18; 25 8.75,1.45; 26 8.75,2.72; 27 8.75,3.99; 28 8.75,5.26 | smd 0.8 x 0.8: 29_1 -2.755,0.79; 29_2 -1.505,0.79; 29_3 -0.255,0.79; 29_4 -2.755,-0.46; 29_5 -1.505,-0.46; 29_6 -0.255,-0.46; 29_7 -2.755,-1.71; 29_8 -1.505,-1.71; 29_9 -0.255,-1.71
SOIC127P1032X265-16N = smd 2.05 x 0.59: 1 -4.655,4.445; 2 -4.655,3.175; 3 -4.655,1.905; 4 -4.655,0.635; 5 -4.655,-0.635; 6 -4.655,-1.905; 7 -4.655,-3.175; 8 -4.655,-4.445; 9 4.655,-4.445; 10 4.655,-3.175; 11 4.655,-1.905; 12 4.655,-0.635; 13 4.655,0.635; 14 4.655,1.905; 15 4.655,3.175; 16 4.655,4.445
SON127P600X800X80-9N = smd 0.94 x 0.44: 1 -3.895,1.905; 2 -3.895,0.635; 3 -3.895,-0.635; 4 -3.895,-1.905; 5 3.895,-1.905; 6 3.895,-0.635; 7 3.895,0.635; 8 3.895,1.905 | smd 3.4 x 4.3: 9 0,0
SOT95P280X120-5N = smd 0.9 x 0.6: 1 -1.4,0.95; 2 -1.4,0; 3 -1.4,-0.95; 4 1.4,-0.95; 5 1.4,0.95
SOT95P280X125-5N = smd 0.9 x 0.6: 1 -1.4,0.95; 2 -1.4,0; 3 -1.4,-0.95; 4 1.4,-0.95; 5 1.4,0.95
ESP32_WROVER_SPARKFUN-IC-POWER_SOT23-5 = smd 0.55 x 1.2: 1 -0.95,-1.3; 2 0,-1.3; 3 0.95,-1.3; 4 0.95,1.3; 5 -0.95,1.3
ESP32_WROVER_BME680_PSON80P300X300X100-8N = smd 1.016 x 0.5: 1 1.458,1.2; 2 1.458,0.4; 3 1.458,-0.4; 4 1.458,-1.2; 5 -1.458,-1.22; 6 -1.458,-0.4; 7 -1.458,0.4; 8 -1.458,1.2

### Placement (x,y rotation side)
BOOT_BUTTON  63.95,108.87 180 top
C1  153.95,9.92 270 top
C1_BAT  116.84,48.11 180 top
C1_BAT1  121.16,33.98 0 top
C2  158.05,9.88 270 top
C2_BAT  123.19,46.93 0 top
C2_BAT1  124.73,34.09 180 top
C3  84.22,23.59 270 top
C3_USB  154.26,51.6 0 top
C4  27.55,108.58 90 top
C4_USB  154.26,50.47 0 top
C5  67.69,108.67 270 top
C6  75.03,21.03 90 top
C7  86.07,49.6 180 top
C8  5.59,98.43 0 top
C9  52.56,108.65 270 top
C_DELAY  26.95,100.49 270 top
C_SUPERCAP  85.98,46.66 90 top
C_TANT  130.18,35.9 270 top
CHANGE_BUTTON  48.95,108.86 180 top
CHG_LED  123.39,41.79 90 top
D1  153.97,54.15 0 top
D2  120.51,36.57 90 top
D3  88.41,23.79 180 top
D4  66.69,27.89 180 top
D5  72.65,27.87 0 top
D6  58.88,20.45 0 top
D7  96.6,49.72 0 top
D8  4.61,78.63 90 top
D9  33.82,53.16 90 top
D10  46.83,57.78 180 top
D11  46.86,54.69 180 top
D12  30.44,58.21 90 top
EPD_C1  79.14,21.05 270 top
EPD_C2  77.87,21.05 270 top
EPD_C3  72.79,21.05 270 top
EPD_C4  71.52,21.05 270 top
EPD_C5  70.25,21.05 270 top
EPD_C6  68.98,21.05 270 top
EPD_C7  67.36,21.07 270 top
EPD_C8  66.03,20.99 270 top
EPD_C9  64.87,20.98 270 top
EPD_C10  63.27,21.06 270 top
J1  72.79,13.43 0 top
J2  167.88,54.06 90 top
J3  165.2,19.11 90 top
J4  5.03,95.89 270 top
L1  81.32,31.75 180 top
PFMF.050.1  156.1,44.85 180 top
Q1  123.51,44.24 0 top
Q2  60.39,23.93 0 top
Q3  83.14,18.69 270 top
R1  18.9,46.79 270 top
R1_BAT  120.93,42.61 90 top
R1_PINH1  155.1,9.88 90 top
R1_PINH2  86.72,63.84 90 top
R1_USB  160.55,55.79 180 top
R2  90.39,17.24 0 top
R2-PINH1  156.35,9.86 90 top
R2_BAT  116.26,45.94 270 top
R2_PINH2  89.26,63.86 90 top
R2_USB  160.51,52.6 0 top
R3  88.03,19.78 90 top
R4  86.76,19.78 90 top
R5  35.48,53.19 270 top
R6  46.82,59.14 0 top
R7  46.84,56.22 0 top
R8  31.84,58.21 270 top
R9  58.92,19.03 180 top
R10  6.37,78.65 270 top
R_BOOT  60.59,108.65 90 top
R_CAPACITOR  93.98,49.62 90 top
R_CHANGE  45.2,108.65 90 top
R_CL1  58.03,23.65 90 top
R_PWRUSB  118.92,36.7 90 top
R_RESET  20.56,108.61 90 top
RESET_BUTTON  23.99,108.87 180 top
SJ1  90.57,19.78 180 top
TP1  11.77,71.98 0 top
TP2  14.65,72.02 0 top
TP3  122.38,50.15 0 top
TP4  5.01,46.74 0 top
TP5  20.17,72.03 0 top
TP6  5.9,72.03 0 top
TP7  15.01,46.81 0 top
TP8  12.88,46.8 0 top
TP9  8.81,71.94 0 top
TP10  21.49,45.35 0 top
TP11  10.76,46.83 0 top
TP12  17.64,72.04 0 top
TP13  54.79,22.96 0 top
TP14  117.55,51.55 0 top
TP15  17.14,46.89 0 top
TP16  8.63,46.79 0 top
TP17  60.68,30.92 0 top
U1  12.67,58.22 90 top
U2  129.41,48.67 0 top
U3  84.8,56.19 270 top
U4  38.51,58.32 0 top
U5  123.94,36.63 0 top
U6  23.83,100.38 0 top
U7  119.53,45.93 90 top
U8  154.4,14.48 90 top

### Tracks (layer width: path | path; a pad name or v marks a point on that pad's centre or on a via)
3V3
  Top 0.3: U1.2 8.69,47.67 | R7.2 47.92,56.22 48.62,56.92 48.62,58.47 48.54,58.55 | 48.54,58.55 47.95,59.14 R6.2 47.35,59.26 47.35,59.84 47.19,59.99 45.64,59.99 45.24,59.59 43.05,59.59 U4.7 | 59.69,24.76 59.74,24.82 60.18,24.82 Q2.3 | 59.69,24.76 59.22,24.3 R_CL1.2 57.91,24.18 57.33,24.18 57.1,23.95 57.1,19.76 57.83,19.03 R9.2 | 59.69,24.76 37.01,47.45 37.01,52.79 | 31.62,50.95 31.62,46 23.49,37.87 15.89,37.87 | 31.62,50.95 31.62,57.38 31.72,57.48 31.76,57.48 R8.2 | R2_PINH2.2 89.26,64.49 88.78,64.01 87.99,64.01 87.96,64.04 | 87.96,64.04 87.96,60.85 U3.2 88.68,60.15 88.68,59.75 97.65,50.78 D7.2 97.66,49.73 102.96,49.73 119.92,32.77 124.65,32.77 125.27,33.4 125.27,33.98 C2_BAT1.1 125.38,34.67 125.68,34.98 125.96,34.98 126.21,35.23 126.21,36.37 | 149.54,18.61 149.79,18.61 150.14,18.97 164.84,18.97 J3.2 | 149.54,18.61 149.52,18.61 151.67,16.46 151.67,9.7 153.7,7.67 158.62,7.67 167.6,16.65 167.6,21.43 157.33,31.7 157.33,48.39 158.65,49.71 158.65,56.21 147.52,67.34 87.05,67.34 47.35,107.04 | 149.54,18.61 130.75,37.4 C_TANT.+ 130.12,37.34 129.54,37.34 128.65,36.45 126.29,36.45 126.21,36.37 | 48.54,58.55 76.22,58.55 82.16,64.49 R1_PINH2.2 87.51,64.49 87.96,64.04 | 44.32,107.5 44.32,107.49 44.78,107.04 47.35,107.04 | 44.32,107.5 44.32,108.99 44.63,109.3 R_CHANGE.2 | 47.35,107.04 57.76,107.04 59.92,109.19 60.49,109.19 R_BOOT.2 | 19.68,102.49 21.8,100.38 U6.2 22.79,100.74 23.29,100.74 30.05,107.5 44.32,107.5 | 19.68,102.49 19.68,108.97 19.98,109.26 R_RESET.2 | R10.2 6.81,78 7.1,78.3 7.1,88.99 6.2,89.89 | 6.2,89.89 5.7,90.39 J4.P4 | C8.1 4.94,96.56 6.2,95.3 | 6.2,95.3 6.2,89.89
  Top 0.3: 19.68,102.49 13.38,102.49 6.2,95.3 | U5.5 125.45,37.47 125.45,37.13 126.21,36.37 | 37.01,52.79 36.75,52.54 R5.2 35.49,51.71 35.24,51.46 32.13,51.46 31.62,50.95 | 8.69,47.67 8.69,39.5 10.32,37.87 15.89,37.87 | 37.01,52.79 37.01,55.29 37.12,55.29 | 37.12,55.29 40.1,55.29 40.77,55.96 40.77,57.31 U4.7 | U4.7 U4.8 | 37.12,55.29 34.74,57.68 U4.3 | R1.2 18.9,40.88 15.89,37.87 | 8.69,47.67 8.69,46.85 TP16.TP
32KHZ  (via drill 0.35)
  Top 0.2: R2_PINH2.1 89.25,63.2 U3.1 89.72,60.37 v90.37,60.37 | v28.35,60.16 18.63,50.44 18.3,50.44 18.17,50.31 18.17,50.06 U1.9
  Bottom 0.2: v28.35,60.16 28.56,60.37 v90.37,60.37
DN  (via drill 0.35)
  Top 0.2: J2.A7 164.82,54.31 165.15,53.97 165.15,53.7 164.76,53.31 J2.B7 164.1,53.2 v163.34,53.2 | D1.4 152.92,53.4 v152.17,52.65
  Bottom 0.2: v163.34,53.2 v163.33,53.21 152.73,53.21 v152.17,52.65
DP  (via drill 0.35)
  Top 0.2: v165.22,54.79 164.22,54.79 J2.B6 164.08,54.69 163.53,54.69 163.4,54.55 163.4,54.06 163.53,53.93 164.08,53.93 J2.A6 | D1.6 155.35,53.9 v156.25,54.81
  Bottom 0.2: v165.22,54.79 156.27,54.79 v156.25,54.81
EPD_3V3
  Top 0.3: TP17.TP 60.68,30.07 61.34,29.41 Q2.2 61.34,19.43 61.34,19.04 66.77,13.62 70.63,13.62 71.04,14.02 J1.16 J1.15 71.53,18.74 72.79,20 EPD_C3.2 73.79,21.4 73.79,21.63 | L1.2 76.74,31.75 73.41,28.42 73.41,22.63 73.79,22.25 73.79,21.63 | C6.1 73.79,21.63
EPD_3V3_C
  Top 0.3: TP13.TP 54.79,22.22 55.35,21.67 55.35,19.82 57.95,17.22 59.78,17.22 60.77,18.21 60.77,21.1 59.49,22.38 59.49,22.88 Q2.1 59.37,23 R_CL1.1 | TP13.TP | U1.18 19.57,66.42 19.57,63.27 14.94,58.64 11.37,58.64 6.67,53.94 6.67,40.65 24.36,22.96 TP13.TP
EPD_BUSY  (via drill 0.35)
  Top 0.2: TP9.TP 8.81,68.37 9.36,67.81 9.36,67.56 U1.26 10.55,66.37 10.55,66.12 12.38,64.29 16.1,64.29 16.97,63.42 v16.97,61.92 | v74.76,16.69 74.76,15.47 74.66,15.37 74.66,15 J1.9
  Bottom 0.2: v16.97,61.92 23.2,61.92 28.12,57 42.81,57 73.28,26.54 73.28,18.17 v74.76,16.69
EPD_CS  (via drill 0.35)
  Top 0.2: U1.11 20.23,49.35 20.23,45.94 20.82,45.35 TP10.TP 22.15,45.35 v25.93,41.57 | J1.12 72.91,15 72.91,15.37 72.13,16.15 v72.13,16.42 | D6.2 59.63,19.09 R9.1 59.57,18.59 v59.03,18.06
  Bottom 0.2: v25.93,41.57 35.52,41.57 v59.03,18.06 60.67,16.42 v72.13,16.42
EPD_DC  (via drill 0.35)
  Top 0.2: U1.5 11.9,48.87 11.9,48.62 10.87,47.59 10.87,46.83 | 10.87,46.83 10.87,40.63 v12.84,38.66 | v73.35,15.95 73.54,15.76 J1.11 | TP11.TP 10.87,46.83
  Bottom 0.2: v12.84,38.66 35.56,15.95 v73.35,15.95
EPD_RST  (via drill 0.35)
  Top 0.2: TP12.TP 17.64,68.55 16.9,67.81 16.9,67.56 U1.21 16.9,66.37 16.9,66.12 17.71,65.31 v17.71,62.93 | v73.87,19.54 74.04,19.37 J1.10
  Bottom 0.2: v17.71,62.93 23.09,62.93 28.69,57.33 42.95,57.33 73.87,26.41 v73.87,19.54
FLASH_CS  (via drill 0.35)
  Top 0.2: R5.1 34.48,53.84 34.45,53.86 33.87,53.86 D9.2 | D9.2 33.92,54.01 33.92,57.96 34.09,58.13 35.24,58.13 35.7,58.59 35.7,59.31 35.29,59.72 35.11,59.72 U4.1 | U1.12 21.98,50.06 21.98,50.31 22.71,51.04 v23.19,51.04 | D9.2 33.64,54.09 v32.37,54.09
  Bottom 0.2: v23.19,51.04 26.24,54.09 v32.37,54.09
GDR
  Top 0.3: R4.2 84.47,20.42 Q3.1 82.85,18.8 81.51,18.8 78.04,15.32 J1.2
GND  (via drill 0.35)
  Top 0.3: U1.29_6 U1.29_3 U1.29_2 | U1.29_6 U1.29_9 U1.29_8 | U1.29_8 U1.29_5 | U1.29_5 | U1.29_5 U1.29_2 | U1.29_2 U1.29_1 U1.29_4 | U1.29_4 U1.29_7 U1.29_8 | U1.29_4 U1.29_5 | U1.29_5 U1.29_6
  other vias: 35.55,55.79 4.49,76.29 153.09,14.72 152.78,9.88 159.03,9.39 163.05,17.83 122.73,34.86 162.85,58.88 151.96,54.24
  pour Top: 63.32,10.29 63.35,10.3 82.26,10.3 82.29,10.29 82.31,10.27 82.32,10.24 82.32,0.41 169.75,0.41 169.75,110.14 0.24,110.14 0.24,67.83 6.31,67.83 6.34,67.82 6.36,67.8 6.38,67.77 6.38,48.67 6.36,48.64 6.34,48.62 6.31,48.61 0.17,48.61 0.17,0.45 63.28,0.45 63.28,10.24 63.3,10.27
  pour Bottom: 63.32,10.29 63.35,10.3 82.26,10.3 82.29,10.29 82.31,10.27 82.32,10.24 82.32,0.41 169.75,0.41 169.75,110.14 0.24,110.14 0.24,67.83 6.31,67.83 6.34,67.82 6.36,67.8 6.38,67.77 6.38,48.67 6.36,48.64 6.34,48.62 6.31,48.61 0.17,48.61 0.17,0.45 63.28,0.45 63.28,10.24 63.3,10.27
GPIO8
  Top 0.2: R1.1 18.85,47.45 U1.10
I2C_PW
  Top 0.3: 154,14.6 U8.2 | 154,14.6 153.2,13.8 U8.8 153.2,11.32 C1.1 155.06,10.57 R1_PINH1.2 155.12,10.5 R2-PINH1.2 158.03,10.5 C2.1 159.95,10.53 166.48,17.06 166.48,20.78 156.25,31.02 156.25,48.93 157.57,50.26 157.57,55.5 146.81,66.26 40.03,66.26 39.7,65.94 22.09,65.94 21.93,66.1 21.93,66.42 U1.17 | U8.6 154.53,13.29 154.53,13.61 154,14.13 154,14.6
INT_RTC  (via drill 0.35)
  Top 0.2: U3.3 86.71,63.17 R1_PINH2.1 86.67,63.14 v85.8,63.14 | v28.59,62.63 16.3,50.35 U1.8 16.3,47.72 TP15.TP
  Bottom 0.2: v85.8,63.14 29.09,63.14 v28.59,62.63
IO/BOOT  (via drill 0.35)
  Top 0.2: U1.15 24.58,66.97 v24.95,66.6 | v60.12,105.74 60.59,106.21 R_BOOT.1 61.27,108.68 61.27,108.74 61.41,108.87 61.45,108.87 BOOT_BUTTON.4 BOOT_BUTTON.3 66,109.32 C5.1
  Bottom 0.2: v60.12,105.74 60.12,101.77 v24.95,66.6 | v24.95,66.6
IO/CHANGE  (via drill 0.35)
  Top 0.2: v46.04,105.65 46.04,99.24 20.07,73.27 17.13,73.27 16.41,72.55 16.41,69.87 14.36,67.81 14.36,67.56 U1.23 | v46.01,107.58 45.62,107.58 45.31,107.89 | C9.1 52.25,109.61 CHANGE_BUTTON.3 CHANGE_BUTTON.4 46.45,108.87 46.41,108.87 45.43,107.89 45.31,107.89 | R_CHANGE.1 45.31,107.89
  Bottom 0.2: v46.04,105.65 46.04,107.55 v46.01,107.58
MISO  (via drill 0.35)
  Top 0.2: U4.2 34.53,58.86 R8.1 30.54,58.86 D12.2 30.09,58.61 v28.1,58.61 | J4.P7 4.24,93.69 2.61,92.05 2.61,75.33 TP6.TP 5.9,70 8.09,67.81 8.09,67.56 U1.27 9.28,66.37 9.28,66.12 11.85,63.55 v15.55,63.55
  Bottom 0.2: v15.55,63.55 23.16,63.55 v28.1,58.61
MOSI  (via drill 0.35)
  Top 0.2: 46.19,54.69 46.2,54.69 46.33,54.69 51.74,49.28 71.12,49.28 93.02,27.37 93.02,17.17 91.66,15.81 90.17,15.81 87.78,13.42 73.09,13.42 72.03,14.48 72.04,14.48 J1.14 | 46.19,54.69 D11.2 45.42,54.69 44.45,55.65 v42.97,55.65 42.97,55.85 U4.5 | 15.03,49.38 U1.7 | J4.P3 5.03,89.21 3.91,88.1 3.91,84.3 3.91,78.8 4.05,78.67 5.1,78.67 5.34,78.42 5.34,74.33 7.13,72.54 7.13,70.12 v7.97,69.28 | v11.87,52.51 13.93,50.44 14.31,50.44 14.44,50.31 14.44,49.97 15.03,49.38 | 15.03,49.38 15.03,46.83 TP7.TP | R7.1 46.19,54.69
  Bottom 0.2: v7.97,69.28 7.58,68.89 7.58,54.48 9.55,52.51 11.83,52.51 | 11.83,52.51 v11.87,52.51 | v42.97,55.65 42.21,54.89 14.22,54.89 11.83,52.51
N$1
  Top 0.3: 121.54,36.15 121.54,37.21 121.89,37.57 122.52,37.57 U5.1 122.54,39 124.82,41.27 124.82,42.89 Q1.2 | 121.54,36.15 122,35.68 U5.3 | C1_BAT1.1 D2.1 121.14,36.15 121.54,36.15
N$2
  Top 0.3: R1_BAT.2 120.93,44.88 U7.1
N$3
  Top 0.3: D4.1 68.8,27.89 76.07,35.15 84.25,35.15 85.27,34.13 85.27,23.95 | C3.1 84.98,24.24 85.27,23.95 | 85.27,23.95 85.43,23.79 D3.2
N$4
  Top 0.2: R2_USB.2 161.16,54.52 160.62,55.05 160.62,57.7 163.67,60.76 165.96,60.76 166.37,60.35 166.37,56.49 165.72,55.84 165.72,53.78 165.15,53.21 165.15,53.19 164.77,52.81 J2.A5
N$5
  Top 0.3: R1_BAT.1 121.61,41.96 121.79,41.79 CHG_LED.C
N$7
  Top 0.2: R1_USB.1 161.2,55.82 163.21,57.84 165.46,57.84 166.04,57.25 166.04,56.83 165.07,55.86 164.25,55.86 J2.B5
N$8
  Top 0.2: C_DELAY.1 25.41,101.14 U6.5
N$9
  Top 0.2: EPD_C8.2 68.04,18.33 J1.22
N$10
  Top 0.2: EPD_C6.2 68.98,14.94 J1.20
N$11
  Top 0.2: EPD_C4.2 71.52,19.55 70.04,18.07 J1.18
N$13
  Top 0.3: U7.5 117.43,44.98 117.12,45.29 R2_BAT.2
N$14
  Top 0.2: J1.19 69.66,15 69.66,18.16 70.25,18.75 EPD_C5.2
N$15
  Top 0.2: EPD_C10.2 67.04,16.64 J1.24
N$16
  Top 0.3: R_CAPACITOR.1 94.46,48.97 95,49.5 95.33,49.5 D7.1
N$24
  Top 0.2: EPD_C2.2 77.87,17.09 76.54,15.76 J1.5
N$25
  Top 0.2: EPD_C1.2 79.14,17.58 77.16,15.6 77.16,15 J1.4
PREVGH
  Top 0.3: D5.1 70.9,24.82 68.1,22.02 68.1,21.15 EPD_C7.2 67.56,20.22 67.56,19.84 68.53,18.87 J1.21
PREVGL
  Top 0.3: D4.2 64.94,24.93 62.28,22.28 62.28,21.5 62.7,21.08 64.1,21.08 65.31,19.87 | J1.23 67.54,15.59 67.54,15.6 67.54,17.64 65.75,19.43 65.31,19.87 | EPD_C9.2 65.31,19.89 65.31,19.87
RESE
  Top 0.3: R3.2 88.01,20.44 88.01,20.83 87.79,21.05 83.81,21.05 Q3.2 82.21,19.46 81.54,19.46 77.54,15.45 J1.3
RESE'
  Top 0.3: R2.1 89.74,19.71 89.79,19.76 SJ1.2 89.3,19.78 88.68,19.15 88.05,19.15 R3.1 | R2.1
RESET  (via drill 0.35)
  Top 0.2: U1.3 9.95,52.97 v10.18,53.19 | v21.07,102.13 21.63,102.13 | 21.63,102.13 U6.1 | C4.1 27.48,107.93 26.54,108.87 26.49,108.87 RESET_BUTTON.3 RESET_BUTTON.4 22.2,109.62 21.32,108.74 21.32,108.71 R_RESET.1 21.63,106.89 21.63,102.13
  Bottom 0.2: v10.18,53.19 10.18,54.8 11,55.63 11,92.05 v21.07,102.13
RTC_RST  (via drill 0.35)
  Top 0.2: U1.16 | U1.16 v22.65,68.21 | v83.72,63.79 85.44,62.07 U3.4
  Bottom 0.2: v22.65,68.21 27.08,63.79 v83.72,63.79
RX
  Top 0.2: U1.24 13.09,67.56 13.09,67.81 14.65,69.37 TP2.TP
SCK  (via drill 0.35)
  Top 0.2: 41.58,56.06 43.79,53.85 46.71,53.85 51.6,48.95 70.98,48.95 92.46,27.47 92.46,17.07 91.52,16.14 90.03,16.14 87.64,13.75 73.25,13.75 72.54,14.46 J1.13 | 41.58,56.06 41.58,56.77 42.41,57.6 U4.6 45.98,57.68 D10.2 46.17,57.87 R6.1 | J4.P5 4.97,91.43 v3.85,91.43 | v11.81,51.38 12.74,50.44 13.04,50.44 13.17,50.31 13.17,50.06 U1.6 13.17,48.87 13.17,47.09 TP8.TP | 41.58,56.06 41.49,56.06 39.55,54.12 v37.81,54.12
  Bottom 0.2: v3.85,91.43 3.85,70.19 6.41,67.63 6.41,54.48 9.51,51.38 v11.81,51.38 15,54.57 37.36,54.57 v37.81,54.12
SCL  (via drill 0.35)
  Top 0.2: 156.34,16.75 155.6,16.01 U8.4 | U1.20 18.17,67.56 18.17,67.81 19.44,69.08 23.79,69.08 25.91,66.97 147.36,66.97 158.27,56.05 158.27,49.87 156.95,48.54 156.95,31.54 167.22,21.27 167.22,16.8 158.46,8.05 157.51,8.05 | 157.51,8.05 153.85,8.05 152.04,9.86 152.04,16.63 152.96,17.54 155.55,17.54 156.34,16.75 | 156.34,16.75 165.64,16.75 166.1,17.21 166.1,20 165.97,20.14 165.67,20.14 J3.4 164.17,21.64 v163.94,21.64 | 157.51,8.05 R2-PINH1.1 | v131.74,48.5 131.31,48.92 U2.7 | v91.59,54.46 91.59,53.88 U3.16
  Bottom 0.2: v163.94,21.64 137.07,48.5 v131.74,48.5 124.6,48.5 118.65,54.46 v91.59,54.46
SDA  (via drill 0.35)
  Top 0.2: U2.8 132.47,51.5 145.55,51.5 150,55.95 156.07,55.95 156.88,55.13 156.88,50.76 155.65,49.53 155.65,28.23 164.28,19.61 J3.3 164.25,19.61 164.13,19.49 v163.9,19.49 | U1.19 19.44,67.56 19.44,67.81 20.38,68.75 23.66,68.75 25.77,66.64 147.02,66.64 157.95,55.71 157.95,50.06 156.62,48.73 156.62,31.17 166.86,20.94 166.86,16.9 159.88,9.93 155.79,9.93 | 155.79,9.93 153.47,9.93 152.37,11.03 152.37,16.15 152.89,16.67 154.31,16.67 154.48,16.5 154.48,16.26 U8.3 154.8,16.61 v155.12,16.93 | 155.79,9.93 R1_PINH1.1 | v88.04,53.73 88.04,51.6 U3.15
  Bottom 0.2: v88.04,53.73 118.32,53.73 v155.12,16.93 157.45,19.26 163.67,19.26 v163.9,19.49
SRC
  Top 0.3: Q3.3 83.71,17.64 85.83,19.76 87.63,19.76 87.66,19.79 88.6,19.79 88.8,19.99 88.8,20.73 88.9,20.83 88.9,20.93 87.07,22.76 84.96,22.76 84.78,22.94 C3.2 83.64,22.94 82.92,23.66 | 82.92,23.66 82.92,31.07 L1.1 | D5.2 78.71,27.87 82.92,23.66
SS_SD  (via drill 0.35)
  Top 0.2: R10.1 6.37,87.24 J4.P2 | U1.4 11.22,55.42 v10.41,56.24 | R10.1 6.37,79.27 5.7,78.6 5.7,75.76 v6.92,74.54 | R10.1 4.68,79.3 D8.2
  Bottom 0.2: v10.41,56.24 8.57,58.07 8.57,72.89 v6.92,74.54
TX
  Top 0.2: TP1.TP 11.77,67.52 U1.25
USB_D+
  Top 0.2: U1.14 23.92,55.11 27.9,59.09 27.98,59.09 29.97,61.08 35.37,61.08 40.18,65.88 106,65.88 120.01,51.88 120.01,43.06 120.39,42.68 121.47,42.68 121.61,42.82 121.61,43.92 121.93,44.24 124.57,44.24 126.33,46.01 142.89,46.01 151.78,54.9 D1.1
USB_D-
  Top 0.2: U1.13 23.25,48.87 23.25,48.62 23.38,48.49 24.47,48.49 31.17,55.19 31.17,58.01 31.45,58.29 33.78,58.29 33.95,58.45 35.1,58.45 35.32,58.67 35.32,59.23 35.15,59.4 34.46,59.4 33.92,59.94 33.92,60.5 34.09,60.67 35.43,60.67 40.32,65.56 105.84,65.56 119.61,51.79 119.61,41.64 120.16,41.09 122.95,41.09 122.96,41.09 123.3,41.09 123.5,41.3 123.5,42.2 123.28,42.41 122.22,42.41 121.94,42.69 121.94,43.78 122.07,43.92 124.7,43.92 126.28,45.5 144.01,45.5 152.41,53.9 D1.3
VBAT
  Top 0.3: C2_BAT.1 122.49,46.88 U7.3 | C2_BAT.1 122.43,47.04 122.43,50.1 TP3.TP | C2_BAT.1 122.54,45.88 123.09,45.34 Q1.3 123.72,45.54 124.16,45.54 125.45,46.84 126.46,46.84 127.95,48.33 128.34,48.33 U2.3 U2.2
VBUS
  Top 0.3: TP14.TP 117.55,50.62 117.47,50.55 117.47,50.37 117.5,50.34 117.49,50.33 C1_BAT.1 117.5,47.61 U7.4 118.29,46.82 118.29,46.38 119.16,45.51 119.16,41.45 121.54,39.07 | 121.54,39.07 120.51,38.04 D2.2 | R_PWRUSB.2 118.94,37.36 120.26,37.36 D2.2 | 152.99,46.41 153.61,47.03 C4_USB.1 C3_USB.1 153.61,52.18 154.82,53.4 D1.5 | PFMF.050.1.2 152.99,45.71 152.99,46.41 | 121.54,39.07 123.19,40.72 123.6,40.72 124.14,41.26 CHG_LED.A 124.13,42.14 123.03,43.24 Q1.1 | D2.2 120.51,36.76 119.78,36.03 119.78,35 119.78,33.51 120.09,33.2 122.41,33.2 123.45,34.24 123.45,34.66 124.18,35.38 124.18,38.82 125.31,39.95 125.31,44 126.44,45.12 151.71,45.12 152.99,46.41
VRTC
  Top 0.3: C7.1 89.17,49.6 89.84,50.27 R_CAPACITOR.2 | C7.1 86.63,49.6 85.98,48.95 C_SUPERCAP.2 | U3.14 86.71,49.62 C7.1
VUSB
  Top 0.3: PFMF.050.1.1 158.87,45.36 158.88,45.36 158.88,47.48 163.17,51.78 | J2.A9 J2.B4 164.13,56.24 163.51,56.24 162.81,55.53 162.81,52.14 163.17,51.78 | J2.B9 J2.A4 164.13,51.44 163.51,51.44 163.17,51.78
(copper drawn outside any net)
  shapes: Top area x12